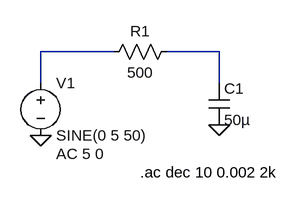
[diagram p0: schematic Low Pass Filter.asc]
Low Pass Filter.asc, the LTspice schematic file:
Version 4.1
SHEET 1 880 680
WIRE 240 32 128 32
WIRE 400 32 320 32
WIRE 128 80 128 32
WIRE 400 80 400 32
FLAG 128 160 0
FLAG 400 144 0
SYMBOL voltage 128 64 R0
WINDOW 123 24 124 Left 2
WINDOW 39 0 0 Left 0
SYMATTR Value2 AC 5 0
SYMATTR InstName V1
SYMATTR Value SINE(0 5 50)
SYMBOL res 336 16 R90
WINDOW 0 0 56 VBottom 2
WINDOW 3 32 56 VTop 2
SYMATTR InstName R1
SYMATTR Value 500
SYMBOL cap 384 80 R0
SYMATTR InstName C1
SYMATTR Value 50µ
TEXT 280 216 Left 2 !.ac dec 10 0.002 2k

The netlist it stands for:
* Low Pass Filter.asc
V1 N001 0 SINE(0 5 50) AC 5 0
R1 N002 N001 500
C1 N002 0 50µ
.ac dec 10 0.002 2k
.backanno
.end